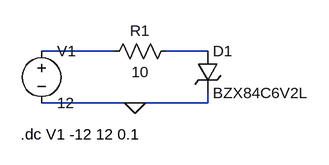
[diagram p0: schematic zener.asc]
zener.asc, the LTspice schematic file:
Version 4
SHEET 1 880 680
WIRE 384 176 272 176
WIRE 528 176 464 176
WIRE 416 256 272 256
WIRE 528 256 528 240
WIRE 528 256 416 256
FLAG 416 256 0
SYMBOL voltage 272 160 R0
SYMATTR InstName V1
SYMATTR Value 12
SYMBOL res 480 160 R90
WINDOW 0 0 56 VBottom 2
WINDOW 3 32 56 VTop 2
SYMATTR InstName R1
SYMATTR Value 10
SYMBOL zener 512 176 R0
SYMATTR InstName D1
SYMATTR Value BZX84C6V2L
TEXT 240 304 Left 2 !.dc V1 -12 12 0.1

The netlist it stands for:
* zener.asc
V1 N001 0 12
R1 N002 N001 10
D1 N002 0 BZX84C6V2L
.model D D
.lib standard.dio
.dc V1 -12 12 0.1
.backanno
.end